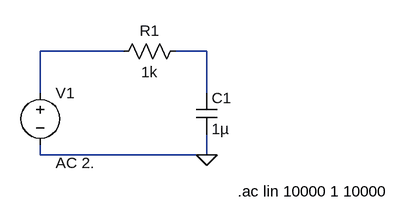
[diagram p0: schematic Low_Pass_voltage.asc]
Low_Pass_voltage.asc, the LTspice schematic file:
Version 4.1
SHEET 1 8128 2232
WIRE 7696 2000 7568 2000
WIRE 7824 2000 7776 2000
WIRE 7568 2064 7568 2000
WIRE 7824 2064 7824 2000
WIRE 7568 2160 7568 2144
WIRE 7824 2160 7824 2128
WIRE 7824 2160 7568 2160
FLAG 7824 2160 0
SYMBOL voltage 7568 2048 R0
WINDOW 123 24 124 Left 2
WINDOW 39 0 0 Left 0
SYMATTR Value2 AC 2.
SYMATTR InstName V1
SYMATTR Value ""
SYMBOL res 7792 1984 R90
WINDOW 0 0 56 VBottom 2
WINDOW 3 32 56 VTop 2
SYMATTR InstName R1
SYMATTR Value 1k
SYMBOL cap 7808 2064 R0
SYMATTR InstName C1
SYMATTR Value 1µ
TEXT 7872 2216 Left 2 !.ac lin 10000 1 10000

The netlist it stands for:
* Low_Pass_voltage.asc
V1 N001 0 AC 2.
R1 N002 N001 1k
C1 N002 0 1µ
.ac lin 10000 1 10000
.backanno
.end